# Altium project Transistorverstaerker.PrjPcb
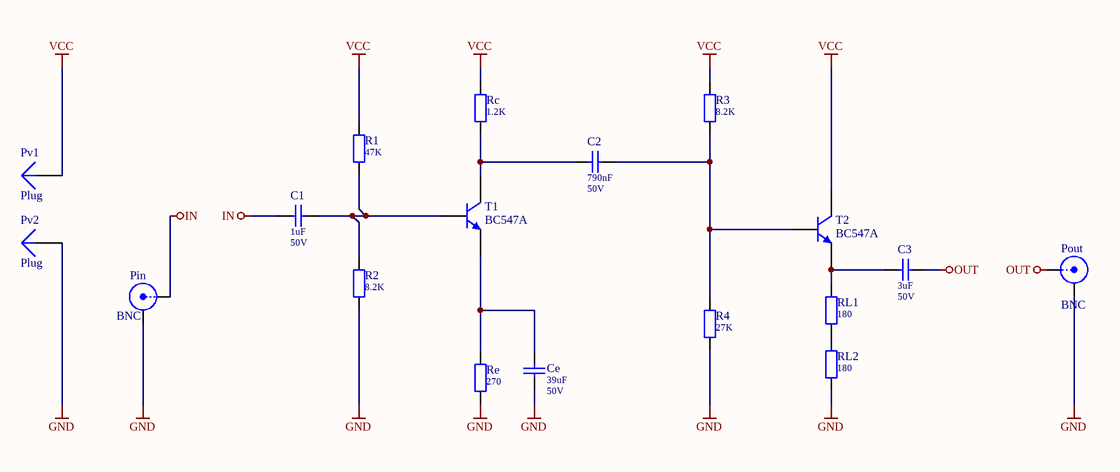
[diagram p0: Transistorverstaerker.SchDoc]
1 sheet, 18 parts. Net scope: global (net labels, ports and power ports of the same name join across sheets).
Board file: Transistorverstaerker.PcbDoc

## Sheet Transistorverstaerker.SchDoc
size A4; DocumentNumber: 1; Revision: 0.1; SheetNumber: 1; SheetTotal: 1; HTL_Gruppe: 4; HTL_Klasse: 3AHEL; HTL_Zusaetzlicher_Titel: Zweistufig; HTL_Schueler_Name: Philipp Dona, Simon Salchner; PageSetup: Record=PageOptions|CenterHorizontal=True|CenterVertical=True|PrintScale=1.00|XCorrection=1.00|YCorrection=1.00|PrintKind=0|BorderSize=5000000|LeftOffset=0|BottomOffset=0|Orientation=2|PaperLength=1000|PaperWidth=1000|Scale=100|PaperSource=7|PrintQuality=-4|MediaType=1|DitherType=10|PaperKind=A4|PrintScaleMode=1; HTL_Projektname: Transistorverstärker; HTL_Dokumentenart: Schaltplan; HTL_Dokumentenstatus: Entwurf; SPICEModelCacheQHNYOTSB: <root> / <DocumentId>QHNYOTSB</DocumentId> / <CacheFrame Number="0"> / <Model Name="qbc547a" Kind="MDL"> / <Text>* / .MODEL QBC547A NPN( / +     IS=1.533E-14 / +     NF=1.002 / +     ISE=7.932E-16 / +     NE=1.436 / +     BF=178.7 / +     IKF=0.1216 / +     VAF=69.7 / +     NR=1.004 / +     ISC=8.305E-14 / +     NC=1.207 / +     BR=8.628 / +     IKR=0.1121 / +     VAR=44.7 / +     RB=1 / +     IRB=1E-06 / +     RBM=1 / +     RE=0.6395 / +     RC=0.6508 / +     XTB=0 / +     EG=1.11 / +     XTI=3 / +     CJE=1.61E-11 / +     VJE=0.4209 / +     MJE=0.3071 / +     TF=4.995E-10 / +     XTF=139 / +     VTF=3.523 / +     ITF=0.7021 / +     PTF=0 / +     CJC=4.388E-12 / +     VJC=0.2 / +     MJC=0.2793 / +     XCJC=0.6193 / +     TR=1E-32 / +     CJS=0 / +     VJS=0.75 / +     MJS=0.333 / +     FC=0.7762 )</Text> / </Model> / </CacheFrame> / </root>

### Parts
C1  Rated Voltage: 50V  [C_RM2-025X075]  (hidden comment: 1uF)
C2  Rated Voltage: 50V  [C_RM2-025X075]  (hidden comment: 790nF)
C3  Rated Voltage: 50V  [C_RM2-025X075]  (hidden comment: 3uF)
Ce  Rated Voltage: 50V  [C_RM2-025X075]  (hidden comment: 39uF)
Pin  BNC  [BNC_RA CON]
Pout  BNC  [BNC_RA CON]
Pv1  Plug  [PIN1]
Pv2  Plug  [PIN1]
R1  47K  [R_0207/RM4]
R2  8.2K  [R_0207/RM4]
R3  8.2K  [R_0207/RM4]
R4  27K  [R_0207/RM4]
Rc  1.2K  [R_0207/RM4]
Re  270  [R_0207/RM4]
RL1  180  [R_0207/RM4]
RL2  180  [R_0207/RM4]
T1  BC547A  [TO-92A-2]
T2  BC547A  [TO-92A-2]

### Nets
GND: Ce.1 Pin.2(Y) Pout.2(Y) Pv2.1 R2.1 R4.1 Re.1 RL2.1
IN: C1.1 Pin.1(X)
OUT: C3.2 Pout.1(X)
VCC: Pv1.1 R1.2 R3.2 Rc.2 T2.3(C)
NetC1_2: C1.2 R1.1 R2.2 T1.2(B)
NetC2_1: C2.1 Rc.1 T1.3(C)
NetC2_2: C2.2 R3.1 R4.2 T2.2(B)
NetC3_1: C3.1 RL1.2 T2.1(E)
NetCe_2: Ce.2 Re.2 T1.1(E)
NetRL1_1: RL1.1 RL2.2

### Notes on the sheet
- Sachnummer / Dateiname:
- Name:
- Gruppe:
- Klasse:
- Elektronik &
- Technische Informatik
- Anichstraße 26 - 28
- HTBLVA
- Titel:
- Datum:
- Dokumentenart:
- Dokumentenstatus:
- A - 6020 Innsbruck
- Ver.:
- Blatt:
- Blätter:

### Library data of the parts
C1-C3 Ce = C: Capacitor; Usage: only permitted for non-commercial purposes at HTL I Innsbruck; Published: 21-Feb-2011; LatestRevisionDate: 07-Sep-2019
  C1: Value: 1uF
  C2: Value: 790nF
  C3: Value: 3uF
  Ce: Value: 39uF
Pin Pout = BNC: BNC Elbow Connector; LatestRevisionDate: 17-Jul-2002; LatestRevisionNote: Re-released for DXP Platform.; Publisher: Altium Limited
R1-R4 Rc Re RL1 RL2 = R: Resistor; Usage: only permitted for non-commercial purposes at HTL I Innsbruck; Published: 21-Feb-2011; LatestRevisionDate: 07-Sep-2019
  R1: Value: 47K
  R2 R3: Value: 8.2K
  R4: Value: 27K
  Rc: Value: 1.2K
  Re: Value: 270
  RL1 RL2: Value: 180
T1 T2 = BC547A: NPN General-purpose Transistor; pin to pad: 1>3 3>1; SimulationModellSource: Philips Discrete BJT - Low Power; Usage: only permitted for non-commercial purposes at HTL I Innsbruck; Published: 21-Feb-2011; LatestRevisionDate: 31-Oct-2012
Pv1 Pv2 = Plug: LatestRevisionDate: 17-Jul-2002; LatestRevisionNote: Re-released for DXP Platform.; Publisher: Altium Limited